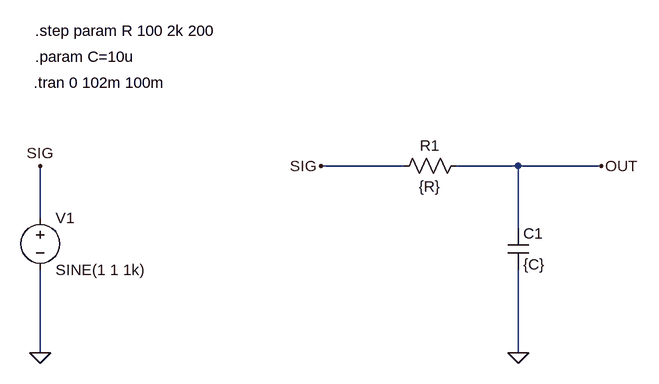
[diagram p0: schematic LPF_RC_step_R.asc]
LPF_RC_step_R.asc, the LTspice schematic file:
Version 4
SHEET 1 880 680
WIRE -160 -128 -288 -128
WIRE 16 -128 -80 -128
WIRE 144 -128 16 -128
WIRE -720 -48 -720 -128
WIRE 16 -32 16 -128
WIRE -720 160 -720 32
WIRE 16 160 16 32
FLAG -288 -128 SIG
FLAG 16 160 0
FLAG -720 -128 SIG
FLAG -720 160 0
FLAG 144 -128 OUT
SYMBOL res -176 -112 R270
WINDOW 0 32 56 VTop 2
WINDOW 3 0 56 VBottom 2
SYMATTR InstName R1
SYMATTR Value {R}
SYMBOL cap 0 -32 R0
SYMATTR InstName C1
SYMATTR Value {C}
SYMBOL voltage -720 -64 R0
WINDOW 123 0 0 Left 2
WINDOW 39 0 0 Left 2
SYMATTR InstName V1
SYMATTR Value SINE(1 1 1k)
TEXT -728 -336 Left 2 !.step param R 100 2k 200
TEXT -728 -296 Left 2 !.param C=10u
TEXT -730 -256 Left 2 !.tran 0 102m 100m

The netlist it stands for:
* LPF_RC_step_R.asc
R1 SIG OUT {R}
C1 OUT 0 {C}
V1 SIG 0 SINE(1 1 1k)
.step param R 100 2k 200
.param C=10u
.tran 0 102m 100m
.backanno
.end

* Results of the author's LTspice run, read from the files saved beside the schematic
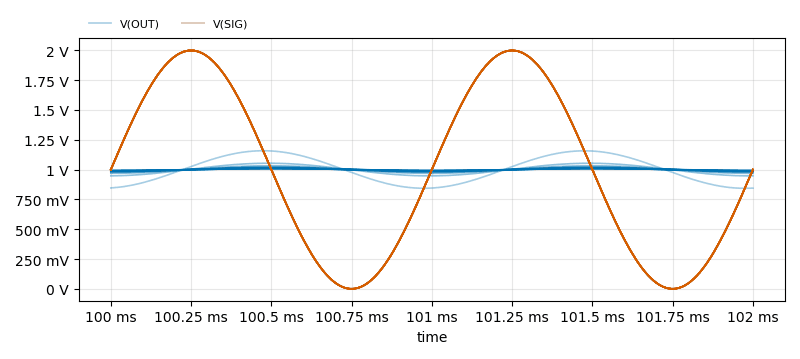
[diagram p1: Transient Analysis of LPF_RC_step_R.asc, plotted from the saved traces]
* Transient Analysis, 21 runs:
*   V(OUT) [run 1]: min 843.6 mV, max 1.158 V, average 1.001 V, rms 1.007 V, last 845 mV
*   V(OUT) [run 2]: 947.6 mV at time=100 ms, 947.6 mV at time=100 ms, min 947.6 mV, max 947.6 mV
*   V(OUT) [run 3]: min 947.4 mV, max 1.053 V, average 1 V, rms 1.001 V, last 947.4 mV
*   V(OUT) [run 4]: min 968.5 mV, max 1.032 V, average 1 V, rms 1.001 V, last 968.5 mV
*   V(OUT) [run 5]: 977.5 mV at time=100 ms, 977.5 mV at time=100 ms, min 977.5 mV, max 977.5 mV
*   V(OUT) [run 6]: min 977.5 mV, max 1.023 V, average 1 V, rms 1 V, last 977.5 mV
*   V(OUT) [run 7]: min 982.5 mV, max 1.018 V, average 1 V, rms 1 V, last 982.5 mV
*   V(OUT) [run 8]: 985.7 mV at time=100 ms, 985.7 mV at time=100 ms, min 985.7 mV, max 985.7 mV
*   V(SIG) [run 1]: min 941 µV, max 1.999 V, average 999.9 mV, rms 1.224 V, last 1 V
*   V(SIG) [run 2]: 1 V at time=100 ms, 1 V at time=100 ms, min 1 V, max 1 V
*   V(SIG) [run 3]: min 941 µV, max 1.998 V, average 999.9 mV, rms 1.224 V, last 1 V
*   V(SIG) [run 4]: min 941 µV, max 1.999 V, average 999.9 mV, rms 1.224 V, last 1 V
*   V(SIG) [run 5]: 1 V at time=100 ms, 1 V at time=100 ms, min 1 V, max 1 V
*   V(SIG) [run 6]: min 941 µV, max 1.999 V, average 999.9 mV, rms 1.224 V, last 1 V
*   V(SIG) [run 7]: min 941 µV, max 1.999 V, average 999.8 mV, rms 1.224 V, last 1 V
*   V(SIG) [run 8]: 1 V at time=100 ms, 1 V at time=100 ms, min 1 V, max 1 V